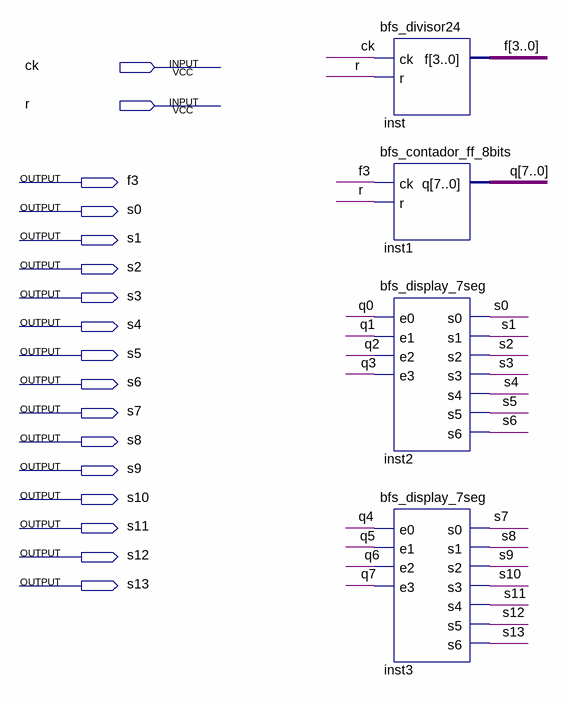
[diagram p0: schematic sheet]
// Quartus schematic bfs_contador_sincrono_8bits.bdf as structural Verilog: 4 symbols, 17 pins
module bfs_contador_sincrono_8bits (
  input  ck,
  input  r,
  output f3,
  output s0,
  output s1,
  output s2,
  output s3,
  output s4,
  output s5,
  output s6,
  output s7,
  output s8,
  output s9,
  output s10,
  output s11,
  output s12,
  output s13
);

  wire [2:0] f;
  wire [7:0] q;

  bfs_divisor24 inst (.ck(ck), .r(r), .f({f3, f}));
  bfs_contador_ff_8bits inst1 (.ck(f3), .r(r), .q(q));
  bfs_display_7seg inst2 (
    .e0(q[0]), .e1(q[1]), .e2(q[2]), .e3(q[3]), .s0(s0), .s1(s1), .s2(s2), .s3(s3), .s4(s4), .s5(s5), .s6(s6));
  bfs_display_7seg inst3 (
    .e0(q[4]), .e1(q[5]), .e2(q[6]), .e3(q[7]), .s0(s7), .s1(s8), .s2(s9), .s3(s10), .s4(s11), .s5(s12),
    .s6(s13));
endmodule
